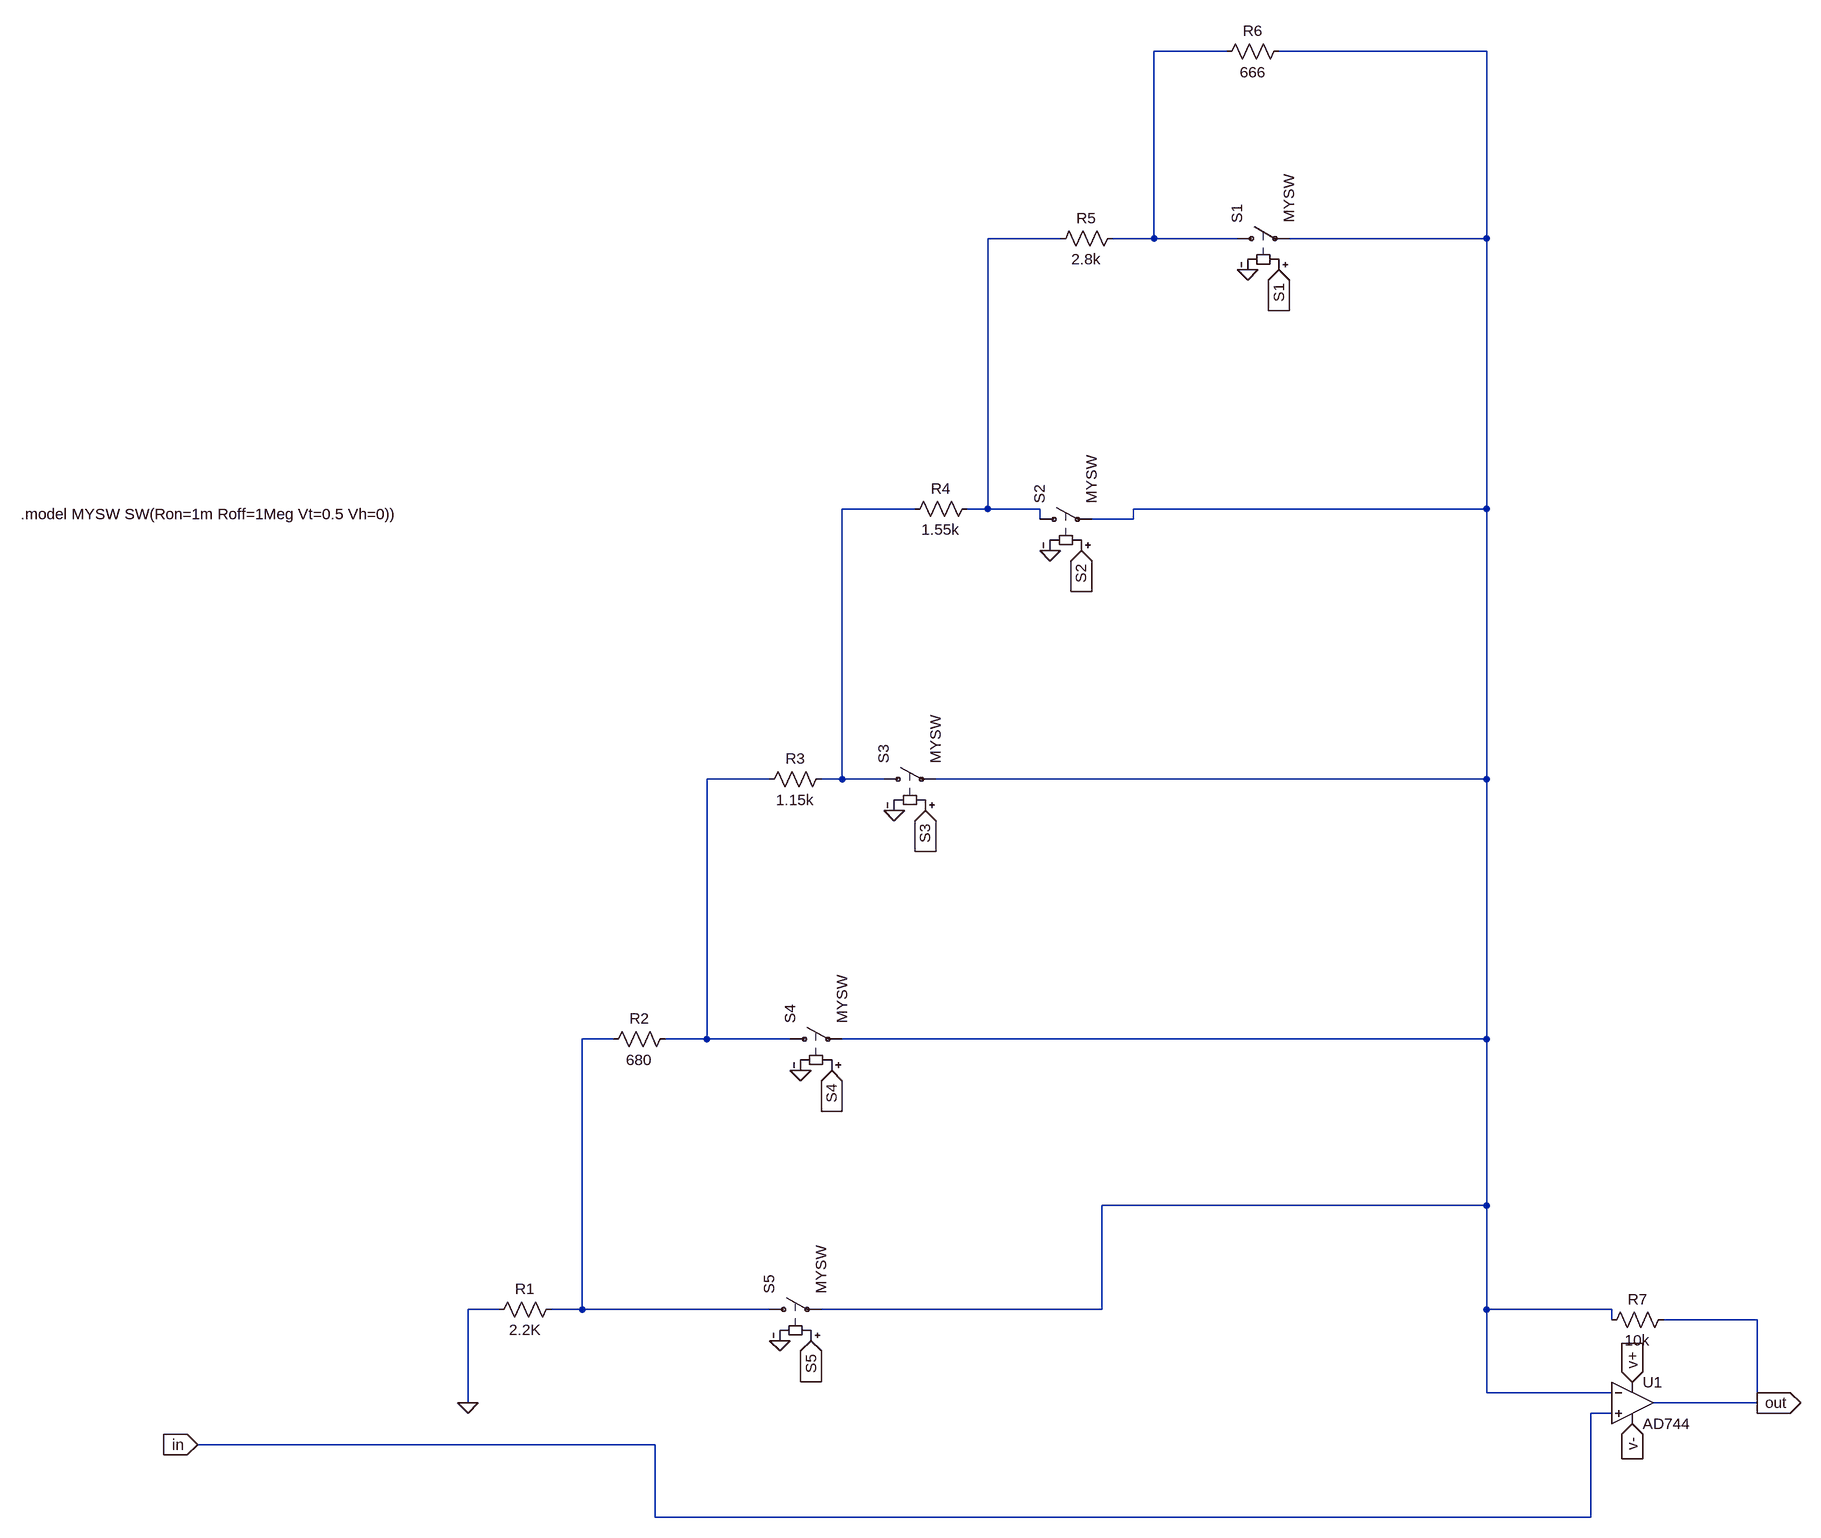
[diagram p0: schematic etj3.asc]
etj3.asc, the LTspice schematic file:
Version 4
SHEET 1 2292 1288
WIRE 768 -1120 656 -1120
WIRE 1168 -1120 848 -1120
WIRE 512 -832 400 -832
WIRE 656 -832 656 -1120
WIRE 656 -832 592 -832
WIRE 784 -832 656 -832
WIRE 1168 -832 1168 -1120
WIRE 1168 -832 864 -832
WIRE 288 -416 176 -416
WIRE 400 -416 400 -832
WIRE 400 -416 368 -416
WIRE 480 -416 400 -416
WIRE 1168 -416 1168 -832
WIRE 1168 -416 624 -416
WIRE 480 -400 480 -416
WIRE 624 -400 624 -416
WIRE 624 -400 560 -400
WIRE 64 0 -32 0
WIRE 176 0 176 -416
WIRE 176 0 144 0
WIRE 240 0 176 0
WIRE 1168 0 1168 -416
WIRE 1168 0 320 0
WIRE -176 400 -224 400
WIRE -32 400 -32 0
WIRE -32 400 -96 400
WIRE 96 400 -32 400
WIRE 1168 400 1168 0
WIRE 1168 400 176 400
WIRE 1168 656 1168 400
WIRE 1168 656 576 656
WIRE -352 816 -400 816
WIRE -224 816 -224 400
WIRE -224 816 -272 816
WIRE 64 816 -224 816
WIRE 576 816 576 656
WIRE 576 816 144 816
WIRE 1168 816 1168 656
WIRE 1360 816 1168 816
WIRE 1360 832 1360 816
WIRE 1584 832 1440 832
WIRE 1168 944 1168 816
WIRE 1360 944 1168 944
WIRE -400 960 -400 816
WIRE 1584 960 1584 832
WIRE 1584 960 1424 960
WIRE 1360 976 1328 976
WIRE -112 1024 -816 1024
WIRE -112 1136 -112 1024
WIRE 1328 1136 1328 976
WIRE 1328 1136 -112 1136
FLAG -400 960 0
FLAG 800 -784 0
FLAG 496 -352 0
FLAG 256 48 0
FLAG 112 448 0
FLAG 1584 960 out
IOPIN 1584 960 Out
FLAG -816 1024 in
IOPIN -816 1024 In
FLAG 128 864 S5
IOPIN 128 864 In
FLAG 80 864 0
FLAG 160 448 S4
IOPIN 160 448 In
FLAG 304 48 S3
IOPIN 304 48 In
FLAG 848 -784 S1
IOPIN 848 -784 In
FLAG 544 -352 S2
IOPIN 544 -352 In
FLAG 1392 928 v+
IOPIN 1392 928 In
FLAG 1392 992 v-
IOPIN 1392 992 In
SYMBOL res -256 800 R90
WINDOW 0 0 56 VBottom 2
WINDOW 3 32 56 VTop 2
SYMATTR InstName R1
SYMATTR Value 2.2K
SYMBOL res -80 384 R90
WINDOW 0 0 56 VBottom 2
WINDOW 3 32 56 VTop 2
SYMATTR InstName R2
SYMATTR Value 680
SYMBOL res 160 -16 R90
WINDOW 0 0 56 VBottom 2
WINDOW 3 32 56 VTop 2
SYMATTR InstName R3
SYMATTR Value 1.15k
SYMBOL res 384 -432 R90
WINDOW 0 0 56 VBottom 2
WINDOW 3 32 56 VTop 2
SYMATTR InstName R4
SYMATTR Value 1.55k
SYMBOL res 608 -848 R90
WINDOW 0 0 56 VBottom 2
WINDOW 3 32 56 VTop 2
SYMATTR InstName R5
SYMATTR Value 2.8k
SYMBOL res 864 -1136 R90
WINDOW 0 0 56 VBottom 2
WINDOW 3 32 56 VTop 2
SYMATTR InstName R6
SYMATTR Value 666
SYMBOL OpAmps\\AD744 1392 896 R0
SYMATTR InstName U1
SYMBOL res 1456 816 R90
WINDOW 0 0 56 VBottom 2
WINDOW 3 32 56 VTop 2
SYMATTR InstName R7
SYMATTR Value 10k
SYMBOL sw 768 -832 R270
SYMATTR InstName S1
SYMATTR Value MYSW
SYMBOL sw 464 -400 R270
SYMATTR InstName S2
SYMATTR Value MYSW
SYMBOL sw 224 0 R270
SYMATTR InstName S3
SYMATTR Value MYSW
SYMBOL sw 80 400 R270
SYMATTR InstName S4
SYMATTR Value MYSW
SYMBOL sw 48 816 R270
SYMATTR InstName S5
SYMATTR Value MYSW
TEXT -1088 -408 Left 2 !.model MYSW SW(Ron=1m Roff=1Meg Vt=0.5 Vh=0))

The netlist it stands for:
* etj3.asc
R1 N006 0 2.2K
R2 N005 N006 680
R3 N004 N005 1.15k
R4 N003 N004 1.55k
R5 N001 N003 2.8k
R6 N002 N001 666
XU1 in N002 v+ v- out AD744  ; pins In+ In- V+ V- OUT
R7 out N002 10k
S1 N001 N002 S1 0 MYSW
S2 N003 N002 S2 0 MYSW
S3 N004 N002 S3 0 MYSW
S4 N005 N002 S4 0 MYSW
S5 N006 N002 S5 0 MYSW
.model MYSW SW(Ron=1m Roff=1Meg Vt=0.5 Vh=0))
.backanno
.end